# Altium project AD7606.PrjPcb
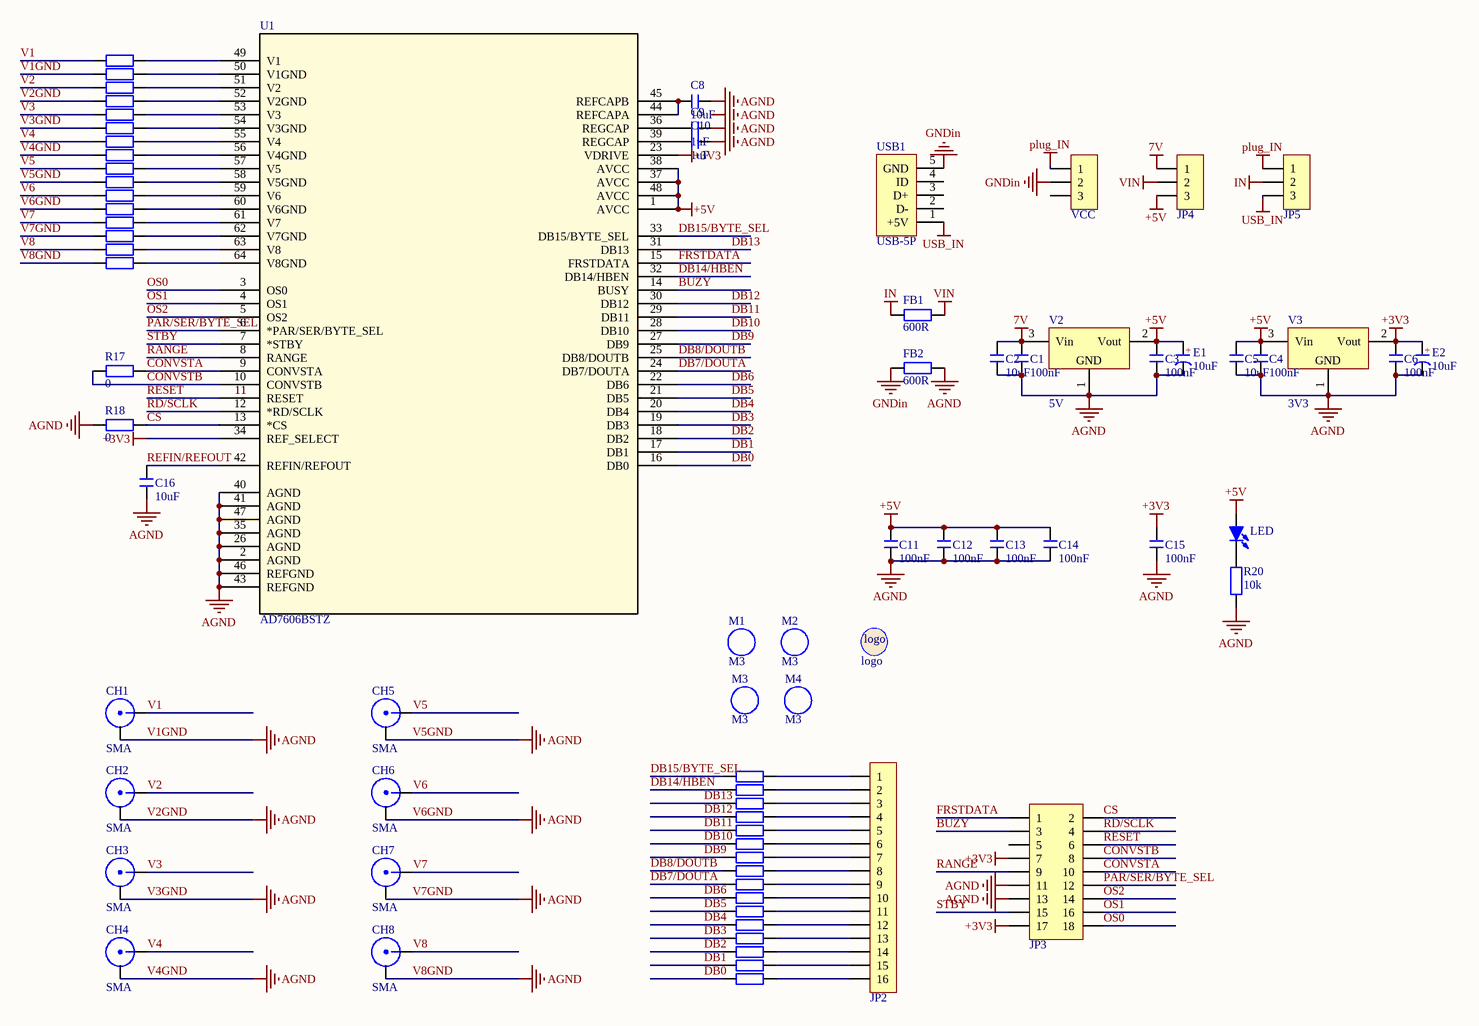
[diagram p0: AD7606.SchDoc]
1 sheet, 77 parts. Net scope: global (net labels, ports and power ports of the same name join across sheets).
Board file: AD7606.PcbDoc

## Sheet AD7606.SchDoc
size A2

### Parts
?  logo  [HuajingDevices]
C1  100nF  [C 0603_L]
C2  10uF  [C 0603_L]
C3  100nF  [C 0603_L]
C4  100nF  [C 0603_L]
C5  10uF  [C 0603_L]
C6  100nF  [C 0603_L]
C8  10uF  [C 0603_L]
C9  1uF  [C 0603_L]
C10  1uF  [C 0603_L]
C11  100nF  [C 0603_L]
C12  100nF  [C 0603_L]
C13  100nF  [C 0603_L]
C14  100nF  [C 0603_L]
C15  100nF  [C 0603_L]
C16  10uF  [C 0603_L]
CH1  SMA  [SMA1]
CH2  SMA  [SMA1]
CH3  SMA  [SMA1]
CH4  SMA  [SMA1]
CH5  SMA  [SMA1]
CH6  SMA  [SMA1]
CH7  SMA  [SMA1]
CH8  SMA  [SMA1]
E1  10uF  [CD B(3528)]
E2  10uF  [CD B(3528)]
FB1  600R  [FB-0805]
FB2  600R  [FB-0805]
JP2  HDR-1X16  [HDR2.54-LI-16P]  (value not drawn)
JP3  Header 9X2  [HDR2.54-LI-2x9P]  (value not drawn)
JP4  HDR-1X3  [HDR2.54-LI-3P]  (value not drawn)
JP5  HDR-1X3  [HDR2.54-LI-3P]  (value not drawn)
LED  (no value)  [LED 0805G]
M1  M3  [M3 125X300]
M2  M3  [M3 125X300]
M3  M3  [M3 125X300]
M4  M3  [M3 125X300]
R1  10K  [R 0603_L]  (value not drawn)
R2  10K  [R 0603_L]  (value not drawn)
R3  10K  [R 0603_L]  (value not drawn)
R4  10K  [R 0603_L]  (value not drawn)
R5  10K  [R 0603_L]  (value not drawn)
R6  10K  [R 0603_L]  (value not drawn)
R7  10K  [R 0603_L]  (value not drawn)
R8  10K  [R 0603_L]  (value not drawn)
R9  10K  [R 0603_L]  (value not drawn)
R10  10K  [R 0603_L]  (value not drawn)
R11  10K  [R 0603_L]  (value not drawn)
R12  10K  [R 0603_L]  (value not drawn)
R13  10K  [R 0603_L]  (value not drawn)
R14  10K  [R 0603_L]  (value not drawn)
R15  10K  [R 0603_L]  (value not drawn)
R16  10K  [R 0603_L]  (value not drawn)
R17  0  [R 0402_L]
R18  0  [R 0402_L]
R20  10k  [R 0603_L]
R21  33  [R 0603_L]  (value not drawn)
R22  33  [R 0603_L]  (value not drawn)
R23  33  [R 0603_L]  (value not drawn)
R24  33  [R 0603_L]  (value not drawn)
R25  33  [R 0603_L]  (value not drawn)
R26  33  [R 0603_L]  (value not drawn)
R27  33  [R 0603_L]  (value not drawn)
R28  33  [R 0603_L]  (value not drawn)
R29  33  [R 0603_L]  (value not drawn)
R30  33  [R 0603_L]  (value not drawn)
R31  33  [R 0603_L]  (value not drawn)
R32  33  [R 0603_L]  (value not drawn)
R33  33  [R 0603_L]  (value not drawn)
R34  33  [R 0603_L]  (value not drawn)
R35  33  [R 0603_L]  (value not drawn)
R36  33  [R 0603_L]  (value not drawn)
U1  AD7606BSTZ  [ST_64_2]
USB1  USB-5P  [USB-MINI-A]
V2  5V  [SOT223_L]
V3  3V3  [SOT223_L]
VCC  HDR-1X3  [XH2.54-LI-3P]  (value not drawn)

### Nets
7V: C1.2 C2.2 JP4.1 V2.3(Vin)
+3V3: C6.2 C15.1 E2.1(A) JP3.7 JP3.17 U1.23(VDRIVE) U1.34(REF_SELECT) V3.2(Vout)
+5V: C3.2 C4.2 C5.2 C11.1 C12.1 C13.1 C14.1 E1.1(A) JP4.3 LED.1(A) U1.1(AVCC) U1.37(AVCC) U1.38(AVCC) U1.48(AVCC) V2.2(Vout) V3.3(Vin)
GNDin: FB2.1 USB1.5(GND) VCC.2
IN: FB1.1 JP5.2
plug_IN: JP5.1 VCC.1
USB_IN: JP5.3 USB1.1(+5V)
V1GND: C1.1 C2.1 C3.1 C4.1 C5.1 C6.1 C8.1 C9.1 C10.1 C11.2 C12.2 C13.2 C14.2 C15.2 C16.2 CH1.2 CH2.2 CH3.2 CH4.2 CH5.2 CH6.2 CH7.2 CH8.2 E1.2(K) E2.2(K) FB2.2 JP3.11 JP3.13 R2.1 R4.1 R6.1 R8.1 R10.1 R12.1 R14.1 R16.1 R18.1 R20.1 U1.2(AGND) U1.26(AGND) U1.35(AGND) U1.40(AGND) U1.41(AGND) U1.43(REFGND) U1.46(REFGND) U1.47(AGND) V2.1(GND) V3.1(GND)  [also labelled AGND, V2GND, V3GND, V4GND, V5GND, V6GND, V7GND, V8GND]
VIN: FB1.2 JP4.2
BUZY: JP3.3 U1.14(BUSY)
CONVSTA: JP3.10 R17.2 U1.9(CONVSTA)
CONVSTB: JP3.8 R17.1 U1.10(CONVSTB)
CS: JP3.2 R18.2 U1.13(*CS)
DB0: R36.1 U1.16(DB0)
DB1: R35.1 U1.17(DB1)
DB2: R34.1 U1.18(DB2)
DB3: R33.1 U1.19(DB3)
DB4: R32.1 U1.20(DB4)
DB5: R31.1 U1.21(DB5)
DB6: R30.1 U1.22(DB6)
DB7/DOUTA: R29.1 U1.24(DB7/DOUTA)
DB8/DOUTB: R28.1 U1.25(DB8/DOUTB)
DB9: R27.1 U1.27(DB9)
DB10: R26.1 U1.28(DB10)
DB11: R25.1 U1.29(DB11)
DB12: R24.1 U1.30(DB12)
DB13: R23.1 U1.31(DB13)
DB14/HBEN: R22.1 U1.32(DB14/HBEN)
DB15/BYTE_SEL: R21.1 U1.33(DB15/BYTE_SEL)
FRSTDATA: JP3.1 U1.15(FRSTDATA)
OS0: JP3.18 U1.3(OS0)
OS1: JP3.16 U1.4(OS1)
OS2: JP3.14 U1.5(OS2)
PAR/SER/BYTE_SEL: JP3.12 U1.6(*PAR/SER/BYTE_SEL)
RANGE: JP3.9 U1.8(RANGE)
RD/SCLK: JP3.4 U1.12(*RD/SCLK)
REFIN/REFOUT: C16.1 U1.42(REFIN/REFOUT)
RESET: JP3.6 U1.11(RESET)
STBY: JP3.15 U1.7(*STBY)
V1: CH1.1 R1.1
V2: CH2.1 R3.1
V3: CH3.1 R5.1
V4: CH4.1 R7.1
V5: CH5.1 R9.1
V6: CH6.1 R11.1
V7: CH7.1 R13.1
V8: CH8.1 R15.1
NetC8_2: C8.2 U1.44(REFCAPA) U1.45(REFCAPB)
NetC9_2: C9.2 U1.36(REGCAP)
NetC10_2: C10.2 U1.39(REGCAP)
NetJP2_1: JP2.1 R21.2
NetJP2_2: JP2.2 R22.2
NetJP2_3: JP2.3 R23.2
NetJP2_4: JP2.4 R24.2
NetJP2_5: JP2.5 R25.2
NetJP2_6: JP2.6 R26.2
NetJP2_7: JP2.7 R27.2
NetJP2_8: JP2.8 R28.2
NetJP2_9: JP2.9 R29.2
NetJP2_10: JP2.10 R30.2
NetJP2_11: JP2.11 R31.2
NetJP2_12: JP2.12 R32.2
NetJP2_13: JP2.13 R33.2
NetJP2_14: JP2.14 R34.2
NetJP2_15: JP2.15 R35.2
NetJP2_16: JP2.16 R36.2
NetLED_2: LED.2(K) R20.2
NetR1_2: R1.2 U1.49(V1)
NetR2_2: R2.2 U1.50(V1GND)
NetR3_2: R3.2 U1.51(V2)
NetR4_2: R4.2 U1.52(V2GND)
NetR5_2: R5.2 U1.53(V3)
NetR6_2: R6.2 U1.54(V3GND)
NetR7_2: R7.2 U1.55(V4)
NetR8_2: R8.2 U1.56(V4GND)
NetR9_2: R9.2 U1.57(V5)
NetR10_2: R10.2 U1.58(V5GND)
NetR11_2: R11.2 U1.59(V6)
NetR12_2: R12.2 U1.60(V6GND)
NetR13_2: R13.2 U1.61(V7)
NetR14_2: R14.2 U1.62(V7GND)
NetR15_2: R15.2 U1.63(V8)
NetR16_2: R16.2 U1.64(V8GND)

Not connected (* = marked no-connect by the designer): JP3 5; USB1 2(D-) 3(D+) 4(ID); VCC 3

### Notes on the sheet
- Labels drawn without touching a wire or pin: AGND
- (in symbol C-CD) +

### Library data of the parts
C1-C6 C8-C16 = C: 无极性贴片电容; 版权归属: 源创客; BOM名称: 无极性贴片电容; 学习资源: www.ooocke.com
E1 E2 = C-CD: 贴片钽电容; 版权归属: 源创客; BOM名称: 贴片钽电容; 学习资源: www.ooocke.com
FB1 FB2 = FB
JP2 = Header 16: 16P接插件; 版权归属: 源创客; BOM名称: 16P接插件; 学习资源: www.ooocke.com
JP3 = Header 9X2: 9*2P接插件; 版权归属: 源创客; BOM名称: 9*2P接插件; 学习资源: www.ooocke.com
JP4 JP5 VCC = Header 3: 3P接插件; 版权归属: 源创客; BOM名称: 3P接插件; 学习资源: www.ooocke.com
LED = LED-SMD: 贴片LED; 版权归属: 源创客; BOM名称: 贴片LED; 学习资源: www.ooocke.com
M1-M4 = M3: 铜柱孔; 版权归属: 源创客; BOM名称: 铜柱孔; 学习资源: www.ooocke.com
R1-R18 R20-R36 = R: 贴片电阻; 版权归属: 源创客; BOM名称: 贴片电阻; 学习资源: www.ooocke.com
U1 = AD7606BSTZ: 8通道同步采样; Copyright: Copyright (C) 2021 Accelerated Designs. All rights reserved; RefDes: RefDes; Type: DEV
USB1 = USB-5P: 微型USB母座; 版权归属: 源创客; BOM名称: 微型USB母座; 学习资源: www.ooocke.com
V2 V3 = AMS1117: 三端稳压芯片; BOM名称: 稳压芯片; 版权归属: 源创客; 学习资源: www.ooocke.com